# Altium schematic sheet KeyInput_IJMEF.SchDoc
size A4
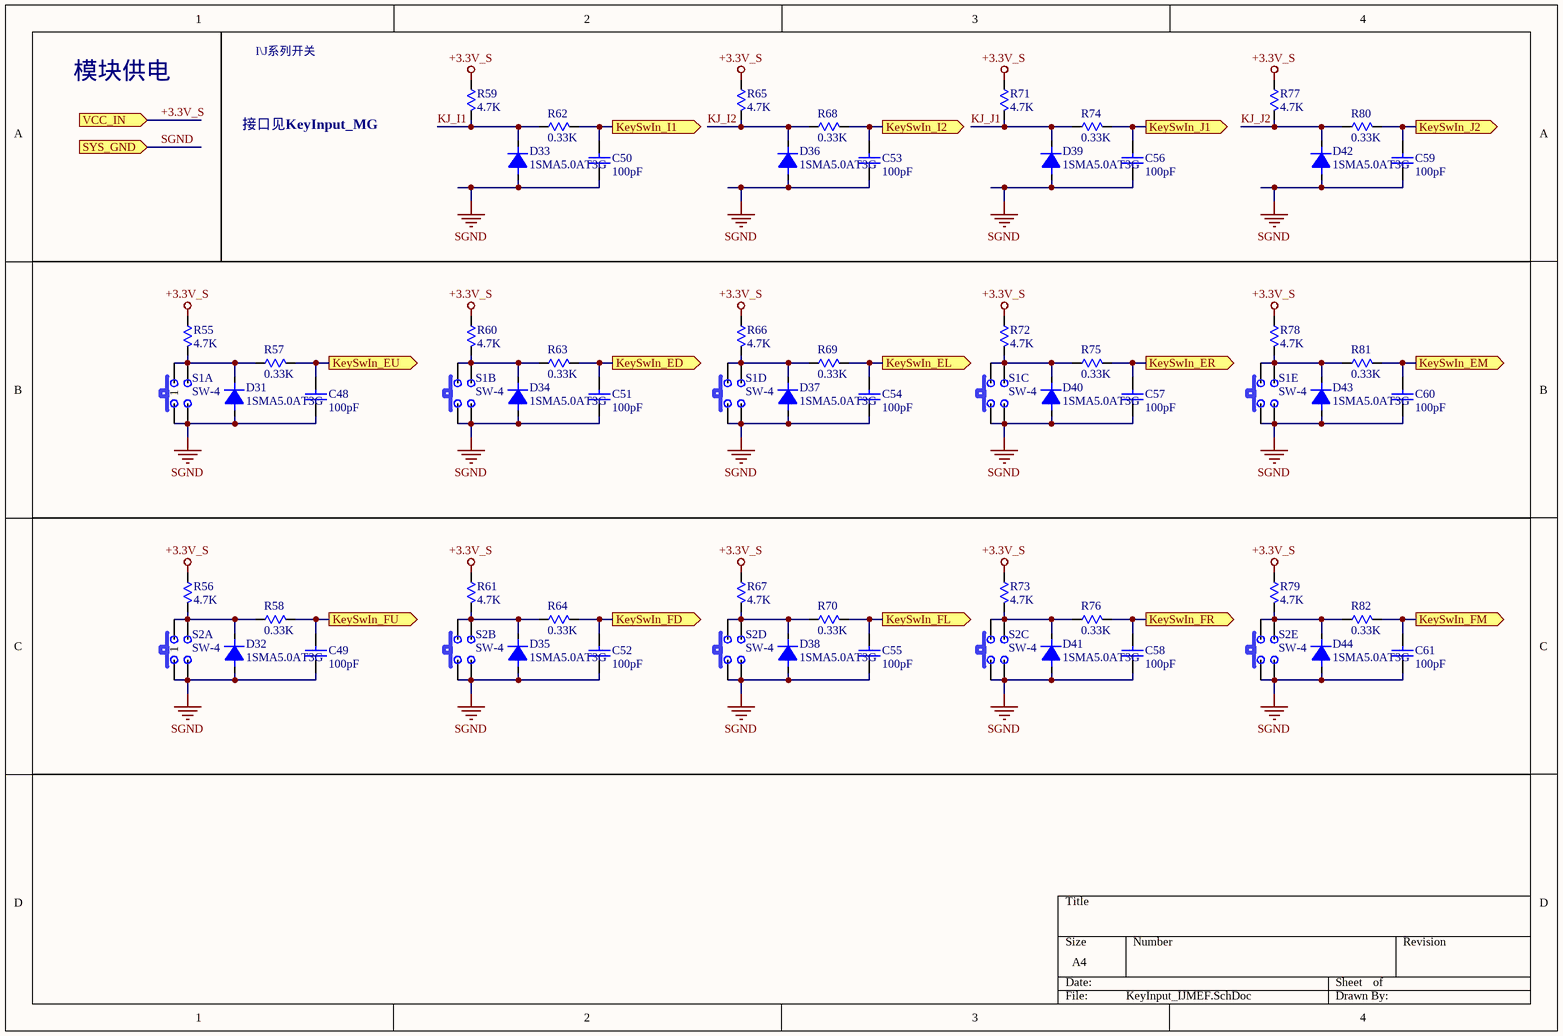
[diagram p0: KeyInput_IJMEF.SchDoc]

## Parts
C48  100pF  [C0805]
C49  100pF  [C0805]
C50  100pF  [C0805]
C51  100pF  [C0805]
C52  100pF  [C0805]
C53  100pF  [C0805]
C54  100pF  [C0805]
C55  100pF  [C0805]
C56  100pF  [C0805]
C57  100pF  [C0805]
C58  100pF  [C0805]
C59  100pF  [C0805]
C60  100pF  [C0805]
C61  100pF  [C0805]
D31  1SMA5.0AT3G  [SMA]
D32  1SMA5.0AT3G  [SMA]
D33  1SMA5.0AT3G  [SMA]
D34  1SMA5.0AT3G  [SMA]
D35  1SMA5.0AT3G  [SMA]
D36  1SMA5.0AT3G  [SMA]
D37  1SMA5.0AT3G  [SMA]
D38  1SMA5.0AT3G  [SMA]
D39  1SMA5.0AT3G  [SMA]
D40  1SMA5.0AT3G  [SMA]
D41  1SMA5.0AT3G  [SMA]
D42  1SMA5.0AT3G  [SMA]
D43  1SMA5.0AT3G  [SMA]
D44  1SMA5.0AT3G  [SMA]
R55  4.7K  [R0805]
R56  4.7K  [R0805]
R57  0.33K  [R0805]
R58  0.33K  [R0805]
R59  4.7K  [R0805]
R60  4.7K  [R0805]
R61  4.7K  [R0805]
R62  0.33K  [R0805]
R63  0.33K  [R0805]
R64  0.33K  [R0805]
R65  4.7K  [R0805]
R66  4.7K  [R0805]
R67  4.7K  [R0805]
R68  0.33K  [R0805]
R69  0.33K  [R0805]
R70  0.33K  [R0805]
R71  4.7K  [R0805]
R72  4.7K  [R0805]
R73  4.7K  [R0805]
R74  0.33K  [R0805]
R75  0.33K  [R0805]
R76  0.33K  [R0805]
R77  4.7K  [R0805]
R78  4.7K  [R0805]
R79  4.7K  [R0805]
R80  0.33K  [R0805]
R81  0.33K  [R0805]
R82  0.33K  [R0805]
S1  SW-4  [SW-MEC-5]  (parts A,B,C,D,E of 5)
S2  SW-4  [SW-MEC-5]  (parts A,B,C,D,E of 5)

## Ports
KeySwIn_ED (out), KeySwIn_EL (out), KeySwIn_EM (out), KeySwIn_ER (out), KeySwIn_EU (out), KeySwIn_FD (out), KeySwIn_FL (out), KeySwIn_FM (out), KeySwIn_FR (out), KeySwIn_FU (out), KeySwIn_I1 (out), KeySwIn_I2 (out), KeySwIn_J1 (out), KeySwIn_J2 (out), SYS_GND (in), VCC_IN (in)

## Nets
+3.3V_S: R55.2 R56.2 R59.2 R60.2 R61.2 R65.2 R66.2 R67.2 R71.2 R72.2 R73.2 R77.2 R78.2 R79.2 ; port VCC_IN
SGND: C48.2 C49.2 C50.2 C51.2 C52.2 C53.2 C54.2 C55.2 C56.2 C57.2 C58.2 C59.2 C60.2 C61.2 D31.1(A) D32.1(A) D33.1(A) D34.1(A) D35.1(A) D36.1(A) D37.1(A) D38.1(A) D39.1(A) D40.1(A) D41.1(A) D42.1(A) D43.1(A) D44.1(A) S1.1 S1.3 S1.5 S1.7 S1.9 S2.1 S2.3 S2.5 S2.7 S2.9 ; port SYS_GND
KeySwIn_ED: C51.1 R63.1 ; port KeySwIn_ED
KeySwIn_EL: C54.1 R69.1 ; port KeySwIn_EL
KeySwIn_EM: C60.1 R81.1 ; port KeySwIn_EM
KeySwIn_ER: C57.1 R75.1 ; port KeySwIn_ER
KeySwIn_EU: C48.1 R57.1 ; port KeySwIn_EU
KeySwIn_FD: C52.1 R64.1 ; port KeySwIn_FD
KeySwIn_FL: C55.1 R70.1 ; port KeySwIn_FL
KeySwIn_FM: C61.1 R82.1 ; port KeySwIn_FM
KeySwIn_FR: C58.1 R76.1 ; port KeySwIn_FR
KeySwIn_FU: C49.1 R58.1 ; port KeySwIn_FU
KeySwIn_I1: C50.1 R62.1 ; port KeySwIn_I1
KeySwIn_I2: C53.1 R68.1 ; port KeySwIn_I2
KeySwIn_J1: C56.1 R74.1 ; port KeySwIn_J1
KeySwIn_J2: C59.1 R80.1 ; port KeySwIn_J2
KJ_I1: D33.2(K) R59.1 R62.2
KJ_I2: D36.2(K) R65.1 R68.2
KJ_J1: D39.2(K) R71.1 R74.2
KJ_J2: D42.2(K) R77.1 R80.2
NetD31_2: D31.2(K) R55.1 R57.2 S1.2
NetD32_2: D32.2(K) R56.1 R58.2 S2.2
NetD34_2: D34.2(K) R60.1 R63.2 S1.4
NetD35_2: D35.2(K) R61.1 R64.2 S2.4
NetD37_2: D37.2(K) R66.1 R69.2 S1.8
NetD38_2: D38.2(K) R67.1 R70.2 S2.8
NetD40_2: D40.2(K) R72.1 R75.2 S1.6
NetD41_2: D41.2(K) R73.1 R76.2 S2.6
NetD43_2: D43.2(K) R78.1 R81.2 S1.10
NetD44_2: D44.2(K) R79.1 R82.2 S2.10

## Notes on the sheet
- 模块供电
- I\J系列开关
- 接口见KeyInput_MG

## Library data of the parts
C48-C61 = Cap: Capacitor; Value: 22pF; Published: 8-Jun-2000; Revision: July-2002: Re-released for DXP Platform.; Publisher: Altium Limited
D31-D44 = DIODE1: Diode
R55-R82 = RES: Resistor; Published: 8-Jun-2000; LatestRevisionDate: 17-Jul-2002; LatestRevisionNote: Re-released for DXP Platform.; PackageReference: AXIAL-0.3; Publisher: Altium Limited
  R55 R56 R59-R61 R65-R67 R71-R73 R77-R79: Value: 4.7K
  R57 R58 R62-R64 R68-R70 R74-R76 R80-R82: Value: 0.33K